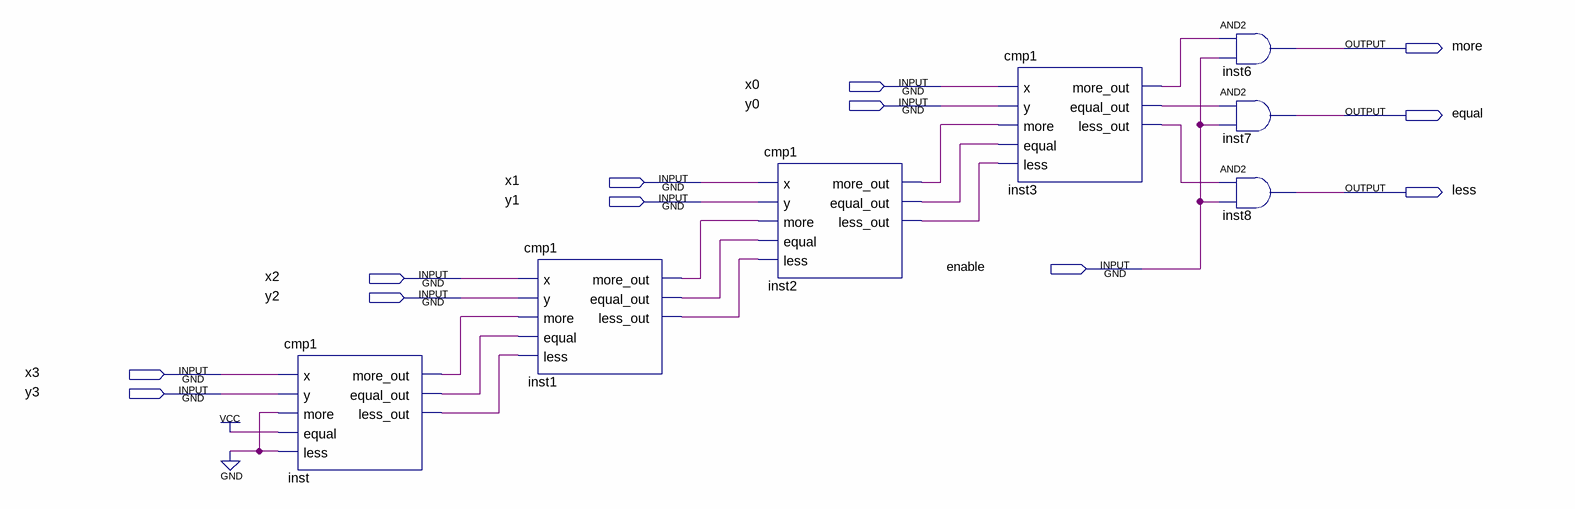
[diagram p0: schematic sheet]
// Quartus schematic lab1.bdf as structural Verilog: 7 symbols, 12 pins
module lab1 (
  input  x0,
  input  y0,
  input  x1,
  input  y1,
  input  enable,
  input  x2,
  input  y2,
  input  x3,
  input  y3,
  output more,
  output equal,
  output less
);

  wire inst1_equal_out, inst1_less_out, inst1_more_out, inst2_equal_out, inst2_less_out, inst2_more_out,
       inst3_equal_out, inst3_less_out, inst3_more_out, inst_equal_out, inst_less_out, inst_more_out;

  cmp1 inst (
    .x(x3), .y(y3), .more(1'b0), .equal(1'b1), .less(1'b0), .more_out(inst_more_out),
    .equal_out(inst_equal_out), .less_out(inst_less_out));
  cmp1 inst1 (
    .x(x2), .y(y2), .more(inst_more_out), .equal(inst_equal_out), .less(inst_less_out),
    .more_out(inst1_more_out), .equal_out(inst1_equal_out), .less_out(inst1_less_out));
  cmp1 inst2 (
    .x(x1), .y(y1), .more(inst1_more_out), .equal(inst1_equal_out), .less(inst1_less_out),
    .more_out(inst2_more_out), .equal_out(inst2_equal_out), .less_out(inst2_less_out));
  cmp1 inst3 (
    .x(x0), .y(y0), .more(inst2_more_out), .equal(inst2_equal_out), .less(inst2_less_out),
    .more_out(inst3_more_out), .equal_out(inst3_equal_out), .less_out(inst3_less_out));
  and inst6 (more, inst3_more_out, enable);
  and inst7 (equal, inst3_equal_out, enable);
  and inst8 (less, inst3_less_out, enable);
endmodule
